# EAGLE design M1_Shield_Radio_V1.3.2 (EAGLE 9.5.2)
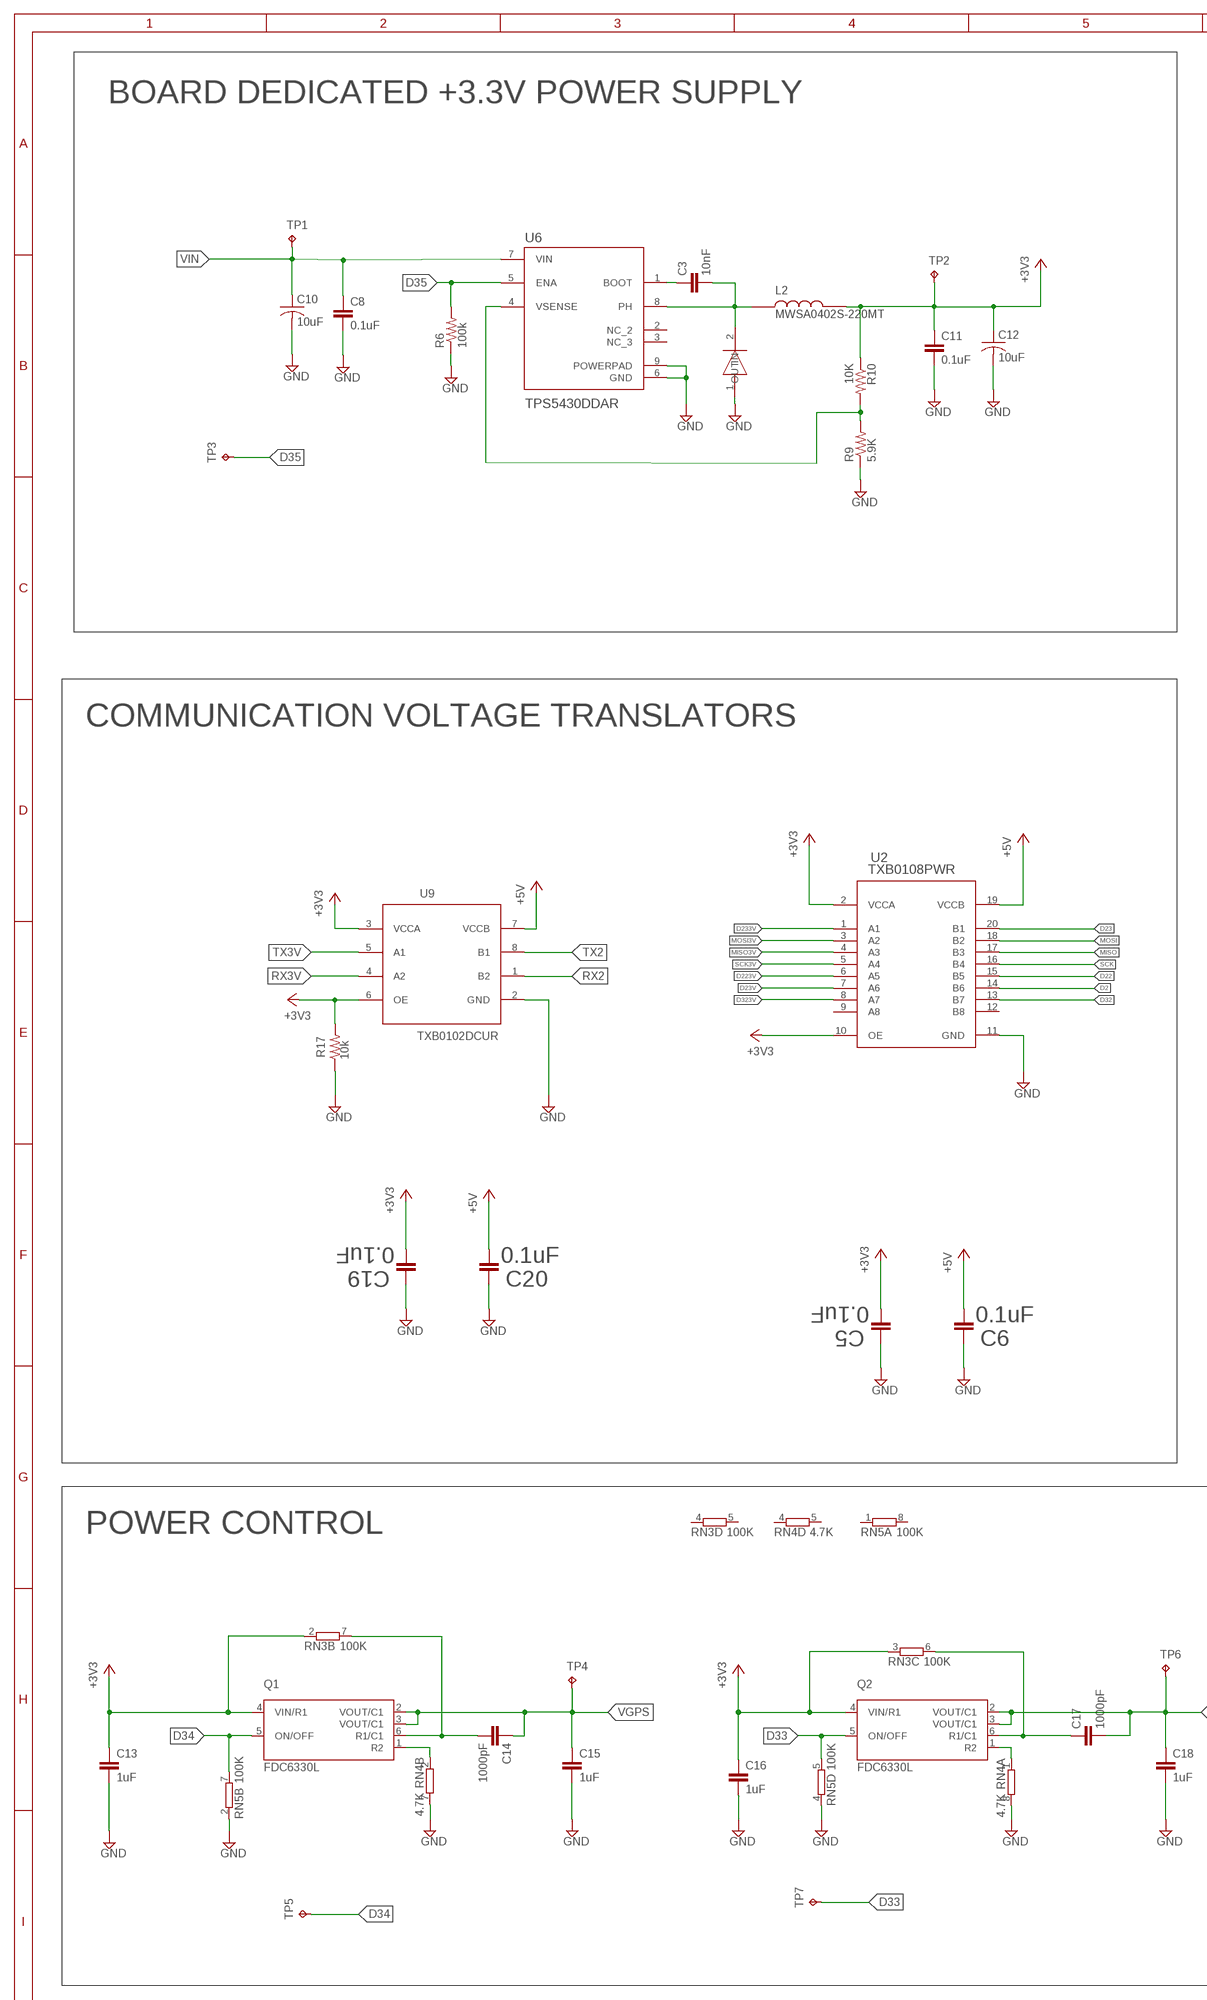
[diagram p0: schematic, sheet 1, part 1 of 2]
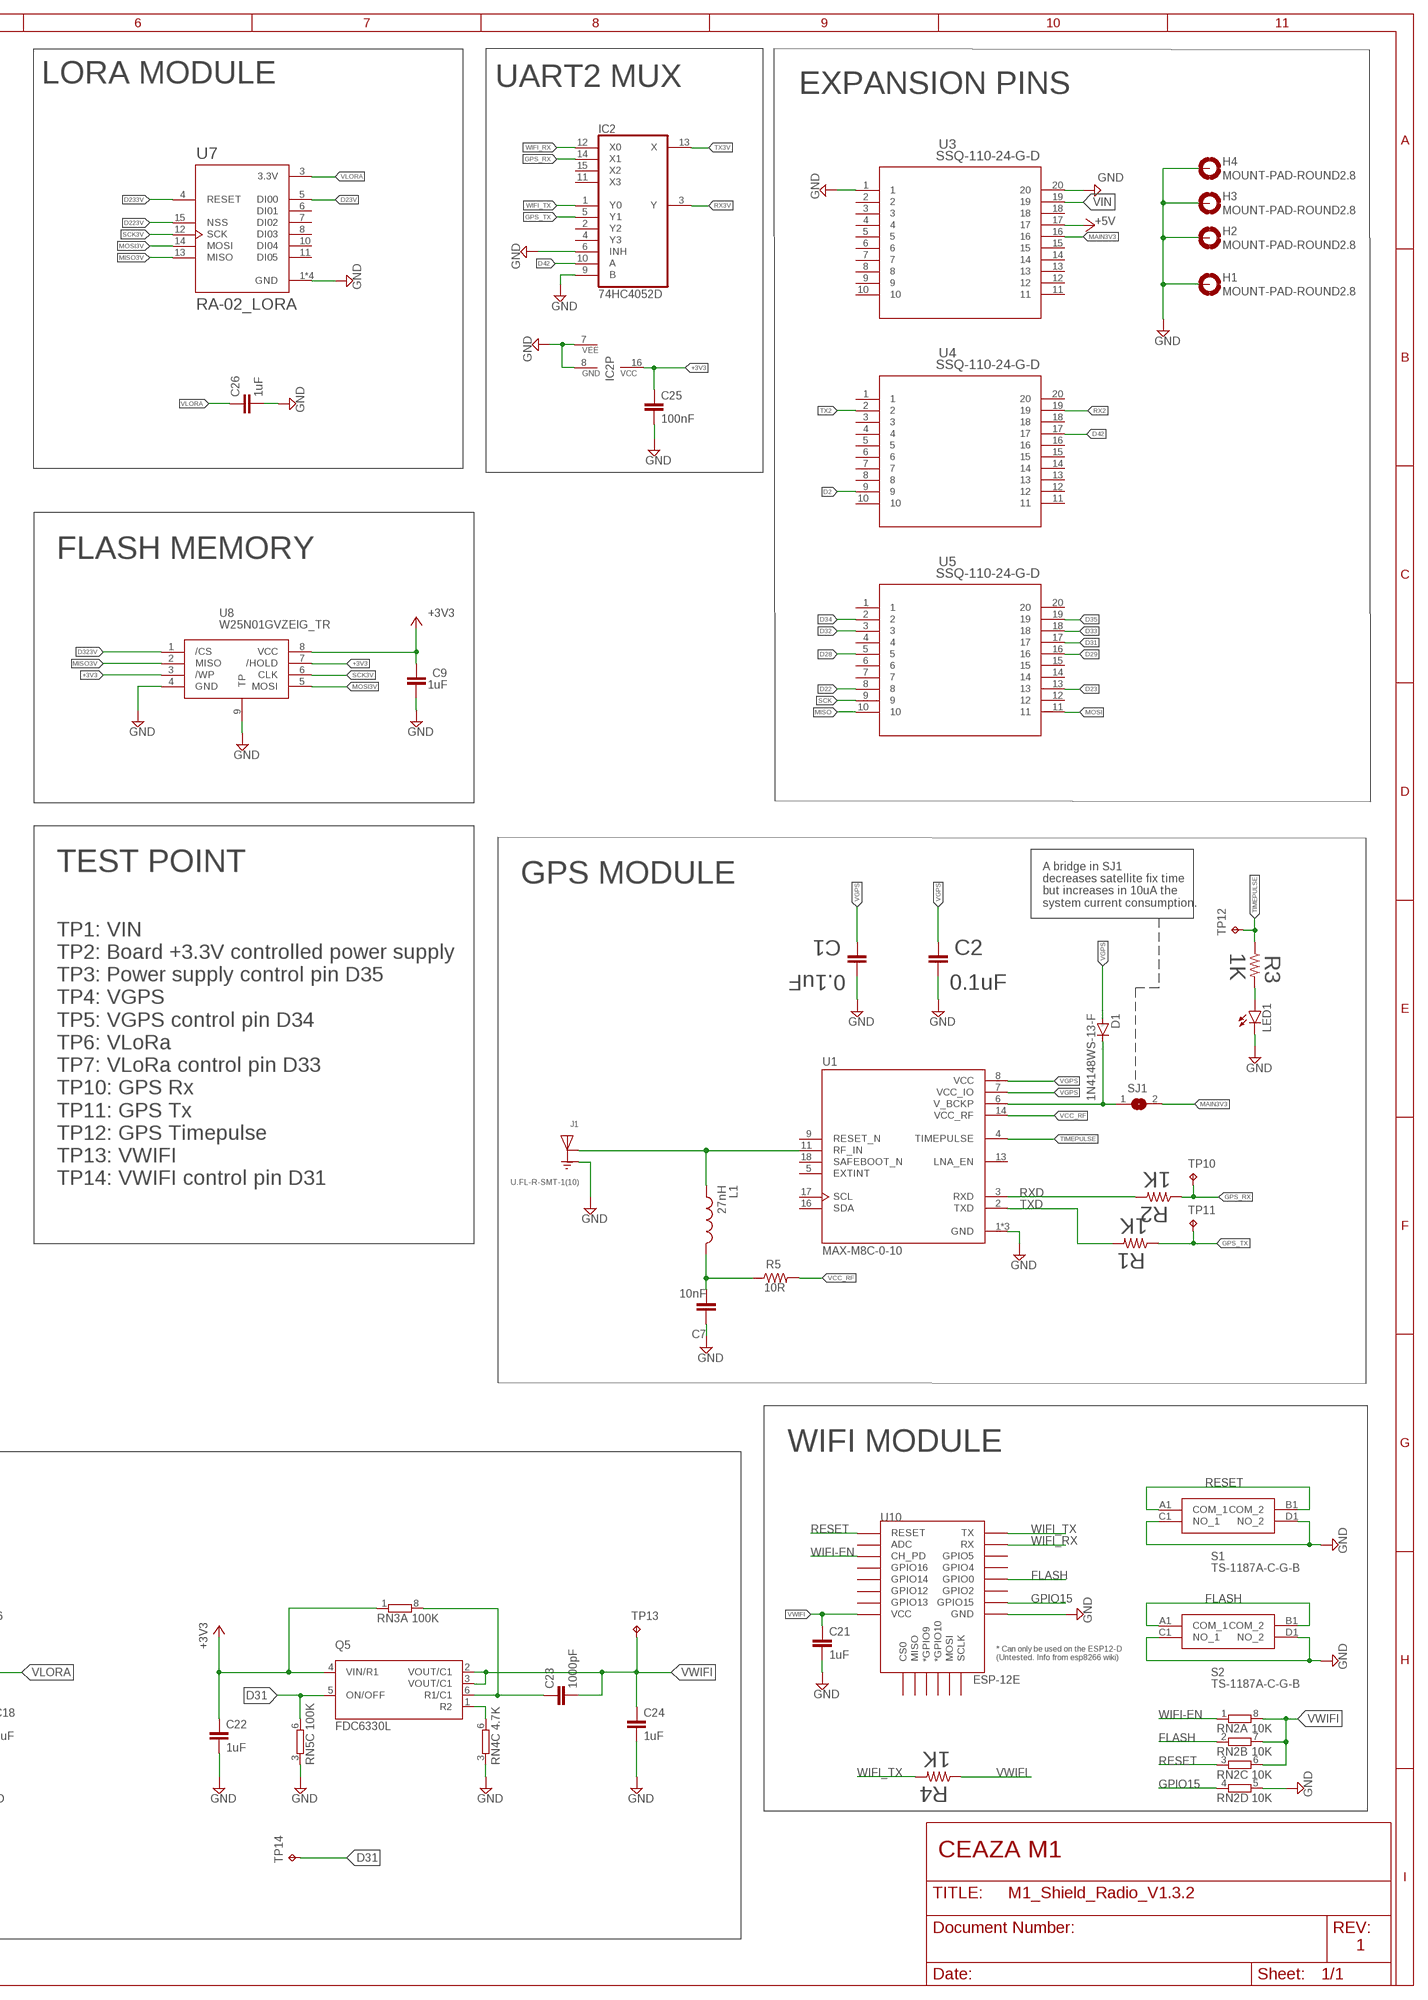
[diagram p1: schematic, sheet 1, part 2 of 2]

## Parts
C1  0.1uF  C-EUC0603K  [C0603K]
C2  0.1uF  C-EUC0603K  [C0603K]
C3  10nF  C-EUC0603K  [C0603K]
C5  0.1uF  C-EUC0603K  [C0603K]
C6  0.1uF  C-EUC0603K  [C0603K]
C7  10nF  C-EUC0603K  [C0603K]
C8  0.1uF  C-EUC0603K  [C0603K]
C9  1uF  C-EUC0603K  [C0603K]
C10  10uF  C-USC0603K  [C0603K]
C11  0.1uF  C-EUC0603K  [C0603K]
C12  10uF  C-USC0603K  [C0603K]
C13  1uF  C-EUC0603K  [C0603K]
C14  1000pF  C-EUC0603K  [C0603K]
C15  1uF  C-EUC0603K  [C0603K]
C16  1uF  C-EUC0603K  [C0603K]
C17  1000pF  C-EUC0603K  [C0603K]
C18  1uF  C-EUC0603K  [C0603K]
C19  0.1uF  C-EUC0603K  [C0603K]
C20  0.1uF  C-EUC0603K  [C0603K]
C21  1uF  C-EUC0603K  [C0603K]
C22  1uF  C-EUC0603K  [C0603K]
C23  1000pF  C-EUC0603K  [C0603K]
C24  1uF  C-EUC0603K  [C0603K]
C25  100nF  C-EUC0603K  [C0603K]
C26  1uF  C-EUC0603K  [C0603K]
D1  1N4148WS-13-F  DIODE-SOD323-W  [SOD323-W]
H1  MOUNT-PAD-ROUND2.8  [2,8-PAD]
H2  MOUNT-PAD-ROUND2.8  [2,8-PAD]
H3  MOUNT-PAD-ROUND2.8  [2,8-PAD]
H4  MOUNT-PAD-ROUND2.8  [2,8-PAD]
IC2  74HC4052D  4052D  [SO16]
J1  U.FL-R-SMT-1(10)  [HRS_U.FL-R-SMT-1(10)]
L1  27nH  LQG15HS27NJ02D  [INDC1005X55N]
L2  MWSA0402S-220MT  [MWSA0402S-220MT]
LED1  LEDCHIP-LED0805  [CHIP-LED0805]
Q1  FDC6330L  [SOT95P280X110-6N]
Q2  FDC6330L  [SOT95P280X110-6N]
Q5  FDC6330L  [SOT95P280X110-6N]
R1  1K  R-US_R0603  [R0603]
R2  1K  R-US_R0603  [R0603]
R3  1K  R-US_R0603  [R0603]
R4  1K  R-US_R0603  [R0603]
R5  10R  R-US_R0603  [R0603]
R6  100k  R-US_R0603  [R0603]
R9  5.9K  R-US_R0603  [R0603]
R10  10K  R-US_R0603  [R0603]
R17  10k  R-US_R0603  [R0603]
RN2  10K  4R-N0603-ARV  [0603-ARV]
RN3  100K  4R-N0603-ARV  [0603-ARV]
RN4  4.7K  4R-N0603-ARV  [0603-ARV]
RN5  100K  4R-N0603-ARV  [0603-ARV]
S1  TS-1187A-C-G-B  [TS1187ACGB]
S2  TS-1187A-C-G-B  [TS1187ACGB]
SJ1  SJ  [SJ]
TP1  TPB1,27  [B1,27]
TP2  TPB1,27  [B1,27]
TP3  TPB1,27  [B1,27]
TP4  TPB1,27  [B1,27]
TP5  TPB1,27  [B1,27]
TP6  TPB1,27  [B1,27]
TP7  TPB1,27  [B1,27]
TP10  TPB1,27  [B1,27]
TP11  TPB1,27  [B1,27]
TP12  TPB1,27  [B1,27]
TP13  TPB1,27  [B1,27]
TP14  TPB1,27  [B1,27]
U1  MAX-M8C-0-10  [XCVR_MAX-M8C-0-10]
U2  TXB0108PWR  [PW0020A_N]
U3  SSQ-110-24-G-D  1-215307-0  [1-215307-0]
U4  SSQ-110-24-G-D  1-215307-0  [1-215307-0]
U5  SSQ-110-24-G-D  1-215307-0  [1-215307-0]
U6  TPS5430DDAR  [CONV_TPS5430DDAR]
U7  RA-02_LORA  [MODULE_RA-02_LORA]
U8  W25N01GVZEIG_TR  [W25N01GVZEIGTR]
U9  TXB0102DCUR  TXB0102DCURDCU0008A_L  [DCU0008A_L]
U10  ESP-12E  ESP12ESMD  [ESP12E-SMD]
U$1  SMA-SS34  [SMA-SS34]

## Nets
+3V3: C5.2 C9.1 C11.1 C12.1 C13.1 C16.1 C19.2 C22.1 C25.1 IC2.16(VCC) L2.P$2 Q1.4(VIN/R1) Q2.4(VIN/R1) Q5.4(VIN/R1) R10.1 R17.2 RN3.1 RN3.2 RN3.3 TP2.TP U2.2(VCCA) U2.10(OE) U8.3(/WP) U8.7(/HOLD) U8.8(VCC) U9.3(VCCA) U9.6(OE)
+5V: C6.2 C20.2 U2.19(VCCB) U3.17 U9.7(VCCB)
D2: U2.14(B6) U4.9
D22: U2.15(B5) U5.8
D23: U2.20(B1) U5.13
D23V: U2.7(A6) U7.5(DI00)
D28: U5.5
D29: U5.16
D31: Q5.5(ON/OFF) RN5.6 TP14.TP U5.17
D32: U2.13(B7) U5.3
D33: Q2.5(ON/OFF) RN5.5 TP7.TP U5.18
D34: Q1.5(ON/OFF) RN5.7 TP5.TP U5.2
D35: R6.2 TP3.TP U5.19 U6.5(ENA)
D42: IC2.10(A) U4.17
D223V: U2.6(A5) U7.15(NSS)
D233V: U2.1(A1) U7.4(RESET)
D323V: U2.8(A7) U8.1(/CS)
FLASH: RN2.2 S2.A1(COM_1) S2.B1(COM_2) U10.GPIO0
GND: C1.1 C2.1 C5.1 C6.1 C7.1 C8.2 C9.2 C10.2 C11.2 C12.2 C13.2 C15.2 C16.2 C18.2 C19.1 C20.1 C21.2 C22.2 C24.2 C25.2 C26.2 H1.B2,8(MOUNT) H2.B2,8(MOUNT) H3.B2,8(MOUNT) H4.B2,8(MOUNT) IC2.6(INH) IC2.7(VEE) IC2.8(GND) IC2.9(B) J1.1(GND) J1.3(GND) LED1.C R6.1 R9.1 R17.1 RN2.5 RN4.3 RN4.7 RN4.8 RN5.2 RN5.3 RN5.4 S1.C1(NO_1) S1.D1(NO_2) S2.C1(NO_1) S2.D1(NO_2) U1.1(GND) U1.10(GND) U1.12(GND) U2.11(GND) U3.1 U3.20 U6.6(GND) U6.9(POWERPAD) U7.1(GND) U7.2(GND) U7.9(GND) U7.16(GND) U8.4(GND) U8.9(TP) U9.2(GND) U10.GND U$1.1(IN)
GPIO15: RN2.4 U10.GPIO15
GPS_RX: IC2.14(X1) R2.1 TP10.TP
GPS_TX: IC2.5(Y1) R1.1 TP11.TP
MAIN3V3: SJ1.2 U3.16
MISO: U2.17(B3) U5.10
MISO3V: U2.4(A3) U7.13(MISO) U8.2(MISO)
MOSI: U2.18(B2) U5.11
MOSI3V: U2.3(A2) U7.14(MOSI) U8.5(MOSI)
N$3: Q5.1(R2) RN4.6
N$4: LED1.A R3.2
N$5: J1.2(SIG) L1.1 U1.11(RF_IN)
N$6: C7.2 L1.2 R5.1
N$7: C3.1 U6.1(BOOT)
N$15: C14.2 Q1.6(R1/C1) RN3.7
N$16: C23.1 Q5.6(R1/C1) RN3.8
N$17: Q1.1(R2) RN4.2
N$19: Q2.1(R2) RN4.1
N$20: C17.1 Q2.6(R1/C1) RN3.6
N$21: D1.C SJ1.1 U1.6(V_BCKP)
N$22: C3.2 L2.P$1 U6.8(PH) U$1.2(OUT)
RESET: RN2.3 S1.A1(COM_1) S1.B1(COM_2) U10.RESET
RX2: U4.19 U9.1(B2)
RX3V: IC2.3(Y) U9.4(A2)
RXD: R2.2 U1.3(RXD)
SCK: U2.16(B4) U5.9
SCK3V: U2.5(A4) U7.12(SCK) U8.6(CLK)
TIMEPULSE: R3.1 TP12.TP U1.4(TIMEPULSE)
TX2: U4.2 U9.8(B1)
TX3V: IC2.13(X) U9.5(A1)
TXD: R1.2 U1.2(TXD)
VCC_RF: R5.2 U1.14(VCC_RF)
VFB: R9.2 R10.2 U6.4(VSENSE)
VGPS: C1.2 C2.2 C14.1 C15.1 D1.A Q1.2(VOUT/C1) Q1.3(VOUT/C1) TP4.TP U1.7(VCC_IO) U1.8(VCC)
VIN: C8.1 C10.1 TP1.TP U3.19 U6.7(VIN)
VLORA: C17.2 C18.1 C26.1 Q2.2(VOUT/C1) Q2.3(VOUT/C1) TP6.TP U7.3(3.3V)
VWIFI: C21.1 C23.2 C24.1 Q5.2(VOUT/C1) Q5.3(VOUT/C1) R4.1 RN2.6 RN2.7 RN2.8 TP13.TP U10.VCC
WIFI-EN: RN2.1 U10.CH_PD
WIFI_RX: IC2.12(X0) U10.RXD0(RX)
WIFI_TX: IC2.1(Y0) R4.2 U10.TXD0(TX)
Unconnected: IC2.2(Y2) IC2.4(Y3) IC2.11(X3) IC2.15(X2) RN3.4 RN3.5 RN4.4 RN4.5 RN5.1 RN5.8 U1.5(EXTINT) U1.9(RESET_N) U1.13(LNA_EN) U1.16(SDA) U1.17(SCL) U1.18(SAFEBOOT_N) U2.9(A8) U2.12(B8) U3.2 U3.3 U3.4 U3.5 U3.6 U3.7 U3.8 U3.9 U3.10 U3.11 U3.12 U3.13 U3.14 U3.15 U3.18 U4.1 U4.3 U4.4 U4.5 U4.6 U4.7 U4.8 U4.10 U4.11 U4.12 U4.13 U4.14 U4.15 U4.16 U4.18 U4.20 U5.1 U5.4 U5.6 U5.7 U5.12 U5.14 U5.15 U5.20 U6.2(NC_2) U6.3(NC_3) U7.6(DI01) U7.7(DI02) U7.8(DI03) U7.10(DI04) U7.11(DI05) U10.ADC U10.CS0 U10.GPIO2 U10.GPIO4 U10.GPIO5 U10.GPIO9(*GPIO9) U10.GPIO10(*GPIO10) U10.GPIO12 U10.GPIO13 U10.GPIO14 U10.GPIO16 U10.MISO U10.MOSI U10.SCLK

## Notes on the sheet
- LORA MODULE | UART2 MUX
- BOARD DEDICATED +3.3V POWER SUPPLY | EXPANSION PINS
- FLASH MEMORY
- COMMUNICATION VOLTAGE TRANSLATORS
- TEST POINT
- GPS MODULE
- A bridge in SJ1 
  decreases satellite fix time 
  but increases in 10uA the 
  system current consumption.
- TP1: VIN
  TP2: Board +3.3V controlled power supply
  TP3: Power supply control pin D35
  TP4: VGPS
  TP5: VGPS control pin D34
  TP6: VLoRa
  TP7: VLoRa control pin D33
  TP10: GPS Rx
  TP11: GPS Tx
  TP12: GPS Timepulse
  TP13: VWIFI
  TP14: VWIFI control pin D31
- WIFI MODULE
- POWER CONTROL
- CEAZA M1
- 1

## Library data of the parts
C1-C3 C5-C9 C11 C13-C26 = rcl:C-EU: CAPACITOR, European symbol; SPICEPREFIX: C
C10 C12 = rcl:C-US: CAPACITOR, American symbol; SPICEPREFIX: C
D1 = diode:DIODE-: DIODE
H1-H4 = holes:MOUNT-PAD-ROUND: MOUNTING PAD, round
IC2 = 40xx:4052: Dual 4-channel ANALOG MULTIPLEXER
J1 = U.FL-R-SMT-1_10_:U.FL-R-SMT-1(10): U.FL Series 6 Ghz 50 Ohm Ultra-small SMT Coaxial Cable Receptacle; DESCRIPTION: U.FL _UMCC_ Connector Receptacle, Male Pin 50Ohm Surface Mount Solder; DIGI-KEY_PART_NUMBER: H11891CT-ND; DIGI-KEY_PURCHASE_URL: https://www.digikey.com/product-detail/en/hirose-electric-co-ltd/U.FL-R-SMT-1_10_/H11891CT-ND/2504612?utm_source=snapeda&utm_medium=aggregator&utm_campaign=symbol; MF: Hirose; MP: U.FL-R-SMT-1_10_; PACKAGE: None
L1 = LQG15HS27NJ02D:LQG15HS27NJ02D: Inductor RF Chip Unshielded Multi-Layer 27nH 5% 100MHz 8Q-Factor Ceramic 300mA 460mOhm DCR 0402 T/R; DESCRIPTION: Inductor with Inductance: 27nH Tol. +/-5%, Package: 0402 _1005_; DIGI-KEY_PART_NUMBER: 490-2628-1-ND; DIGI-KEY_PURCHASE_URL: https://www.digikey.cl/product-detail/en/murata-electronics/LQG15HS27NJ02D/490-2628-1-ND/662908?utm_source=snapeda&utm_medium=aggregator&utm_campaign=symbol; MF: Murata; MP: LQG15HS27NJ02D; PACKAGE: 1005 Murata
L2 = MWSA0402S-220MT:MWSA0402S-220MT
LED1 = led:LED: LED OSRAM: - CHIPLED LG R971, LG N971, LY N971, LG Q971, LY Q971, LO R971, LY R971 LH N974, LH R974 LS Q976, LO Q976, LY Q976 LO Q996 - Hyper CHIPLED LW Q18S LB Q993, LB Q99A, LB R99A - SideLED LS A670, LO A670, LY A670, LG A670, LP A670 LB A673, LV A673, LT A673, LW A673 LH A674 LY A675 LS A676, LA A676, LO A676, LY A676, LW A676 LS A679, LY A679, LG A679 - Hyper Micro SIDELED® LS Y876, LA Y876, LO Y876, LY Y876 LT Y87S - SmartLED LW L88C, LW L88S LB L89C, LB L89S, LG L890 LS L89K, LO L89K, LY L89K LS L896, LA L896, LO L896, LY L896 - TOPLED LS T670, LO T670, LY T670, LG T670, LP T670 LSG T670, LSP T670, LSY T670, LOP T670, LYG T670 LG T671, LOG T671, LSG T671 LB T673, LV T673, LT T673, LW T673 LH T674 LS T676, LA T676, LO T676, LY T676, LB T676, LH T676, LSB T676, LW T676 LB T67C, LV T67C, LT T67C, LS T67K, LO T67K, LY T67K, LW E67C LS E67B, LA E67B, LO E67B, LY E67B, LB E67C, LV E67C, LT E67C LW T67C LS T679, LY T679, LG T679 LS T770, LO T770, LY T770, LG T770, LP T770 LB T773, LV T773, LT T773, LW T773 LH T774 LS E675, LA E675, LY E675, LS T675 LS T776, LA T776, LO T776, LY T776, LB T776 LHGB T686 LT T68C, LB T68C - Hyper Mini TOPLED® LB M676 - Mini TOPLED Santana® LG M470 LS M47K, LO M47K, LY M47K Source: http://www.osram.convergy.de LUXEON: - LUMILED® LXK2-PW12-R00, LXK2-PW12-S00, LXK2-PW14-U00, LXK2-PW14-V00 LXK2-PM12-R00, LXK2-PM12-S00, LXK2-PM14-U00 LXK2-PE12-Q00, LXK2-PE12-R00, LXK2-PE12-S00, LXK2-PE14-T00, LXK2-PE14-U00 LXK2-PB12-K00, LXK2-PB12-L00, LXK2-PB12-M00, LXK2-PB14-N00, LXK2-PB14-P00, LXK2-PB14-Q00 LXK2-PR12-L00, LXK2-PR12-M00, LXK2-PR14-Q00, LXK2-PR14-R00 LXK2-PD12-Q00, LXK2-PD12-R00, LXK2-PD12-S00 LXK2-PH12-R00, LXK2-PH12-S00 LXK2-PL12-P00, LXK2-PL12-Q00, LXK2-PL12-R00 Source: www.luxeon.com KINGBRIGHT: KA-3528ASYC Source: www.kingbright.com
Q1 Q2 Q5 = FDC6330L:FDC6330L: FDC6330 Series 20 V 2.3 A High Side Integrated Load Switch - SSOT-6; DESCRIPTION: Power Switch/Driver 1:1 P-Channel 2.3A SuperSOT™-6; DIGI-KEY_PART_NUMBER: FDC6330LCT-ND; DIGI-KEY_PURCHASE_URL: https://www.digikey.com/product-detail/en/on-semiconductor/FDC6330L/FDC6330LCT-ND/1626189?utm_source=snapeda&utm_medium=aggregator&utm_campaign=symbol; MF: ON Semiconductor; MP: FDC6330L; PACKAGE: TSOT-23-6 ON Semiconductor
R1-R6 R9 R10 R17 = rcl:R-US_: RESISTOR, American symbol; SPICEPREFIX: R
RN2-RN5 = resistor-dil:4R-N: Array Chip Resistor Source: RS Component / Phycomp; OC_FARNELL: unknown; OC_NEWARK: unknown
S1 S2 = TS-1187A-C-G-B:TS-1187A-C-G-B: Tact Switch Source: Datasheet <https://datasheet.lcsc.com/szlcsc/XKB-TS-1187A-C-G-A_C318886.pdf>; DESCRIPTION: Tact Switch; HEIGHT: 3.7mm; MANUFACTURER_NAME: XKB Enterprise; MANUFACTURER_PART_NUMBER: TS-1187A-C-G-B
SJ1 = jumper:SJ: SMD solder JUMPER
TP1-TP7 TP10-TP14 = testpad:TP: Test pad
U1 = MAX-M8C-0-10:MAX-M8C-0-10: Ic Receiver Gps/Gnss 18lcc; DESCRIPTION: u-blox M8 GNSS module, ROM, crystal; DIGI-KEY_PART_NUMBER: 672-1002-1-ND; DIGI-KEY_PURCHASE_URL: https://www.digikey.com/product-detail/en/u-blox/MAX-M8C-0-10/672-1002-1-ND/6150665?utm_source=snapeda&utm_medium=aggregator&utm_campaign=symbol; MF: U-Blox America; MP: MAX-M8C-0-10; PACKAGE: SMD-18 u-blox
U2 = TXB0108PWR:TXB0108PWR; MANUFACTURER: Texas Instruments; PARTNUMBER: TXB0108PWR; REFDES: RefDes; TYPE: TYPE; VALUE: Value
U3-U5 = 1-215307-0:1-215307-0; BUILT_BY: EMA_UL_Team; MANUFACTURER_PART_NUMBER: 1-215307-0; VENDOR: TE Connectivity
U6 = TPS5430DDAR:TPS5430DDAR: 5.5V to 36V Input, 3A, 500kHz Step-Down Converter 8-SO PowerPAD -40 to 125 Check prices <https://snapeda.com/parts/TPS5430DDAR/Texas%20Instruments/view-part/?ref=eda>; ARROW_ELECTRONICS-PURCHASE-URL: https://snapeda.com/shop?store=Arrow+Electronics&id=423058; AVAILABILITY: Good; DESCRIPTION: 5.5V to 36V Input, 3A, 500kHz Step-Down Converter 8-SO PowerPAD -40 to 125; DIGIKEY-PURCHASE-URL: https://snapeda.com/shop?store=DigiKey&id=423058; MF: Texas Instruments; MOUSER-PURCHASE-URL: https://snapeda.com/shop?store=Mouser&id=423058; MP: TPS5430DDAR; PACKAGE: HSOIC-8 Texas Instruments; PRICE: None; TEXAS_INSTRUMENTS-PURCHASE-URL: https://snapeda.com/shop?store=Texas+Instruments&id=423058
U7 = RA-02_LORA:RA-02_LORA: Ra-02 LoRa RF M5Stack Platform Evaluation Expansion Board; AVAILABILITY: Unavailable; DESCRIPTION: Ra-02 LoRa RF M5Stack Platform Evaluation Expansion Board; MF: AI-Thinker; MP: Ra-02 LoRa; PACKAGE: Package; PRICE: None
U8 = W25N01GVZEIG_TR:W25N01GVZEIG_TR
U9 = TXB0102DCUT:TXB0102DCUR; ALTERNATE_PARTNUMBER: TXB0102DCUT; COMPTYPE: IC; MANUFACTURER: Texas Instruments; MOUNTTYPE: SMT; PACKAGEREFERENCE: DCU0008A; PARTNUMBER: TXB0102DCUR; PIN_COUNT: 8; REFDES: RefDes; ROHS: Y; TYPE: TYPE; VALUE: Value
U10 = esp8266modules:ESP12E: ESP12E Module
U$1 = SMA-SS34:SMA-SS34

## Board
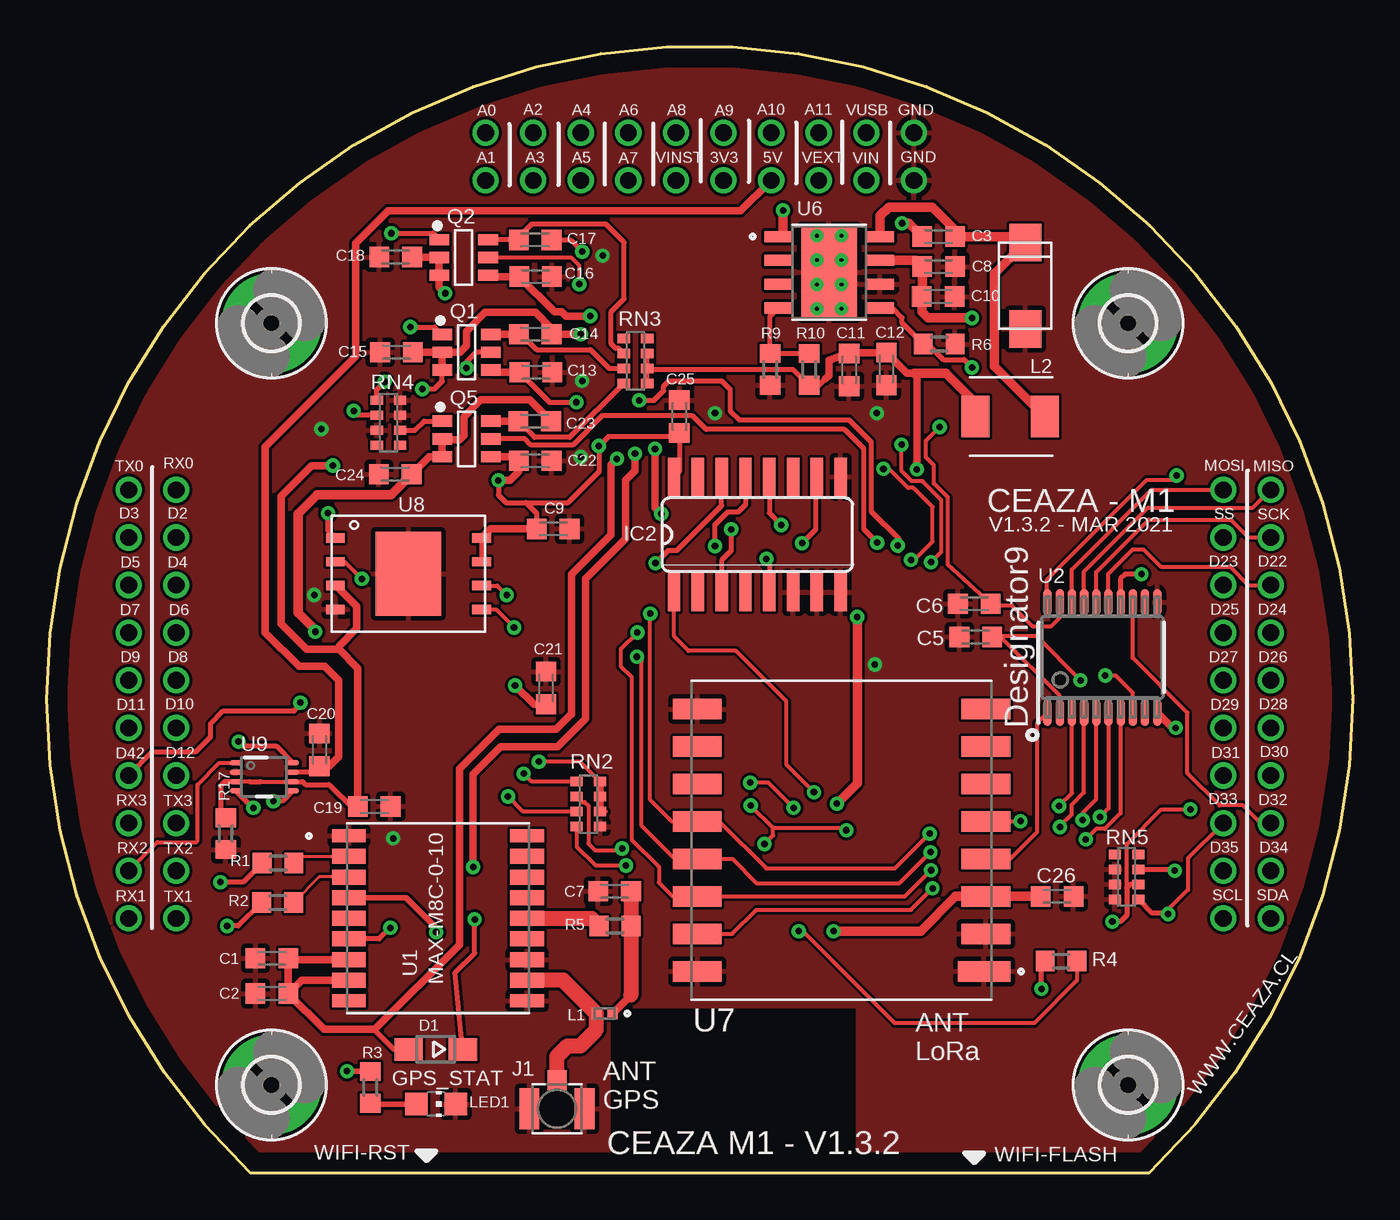
[diagram p2: board, top side]
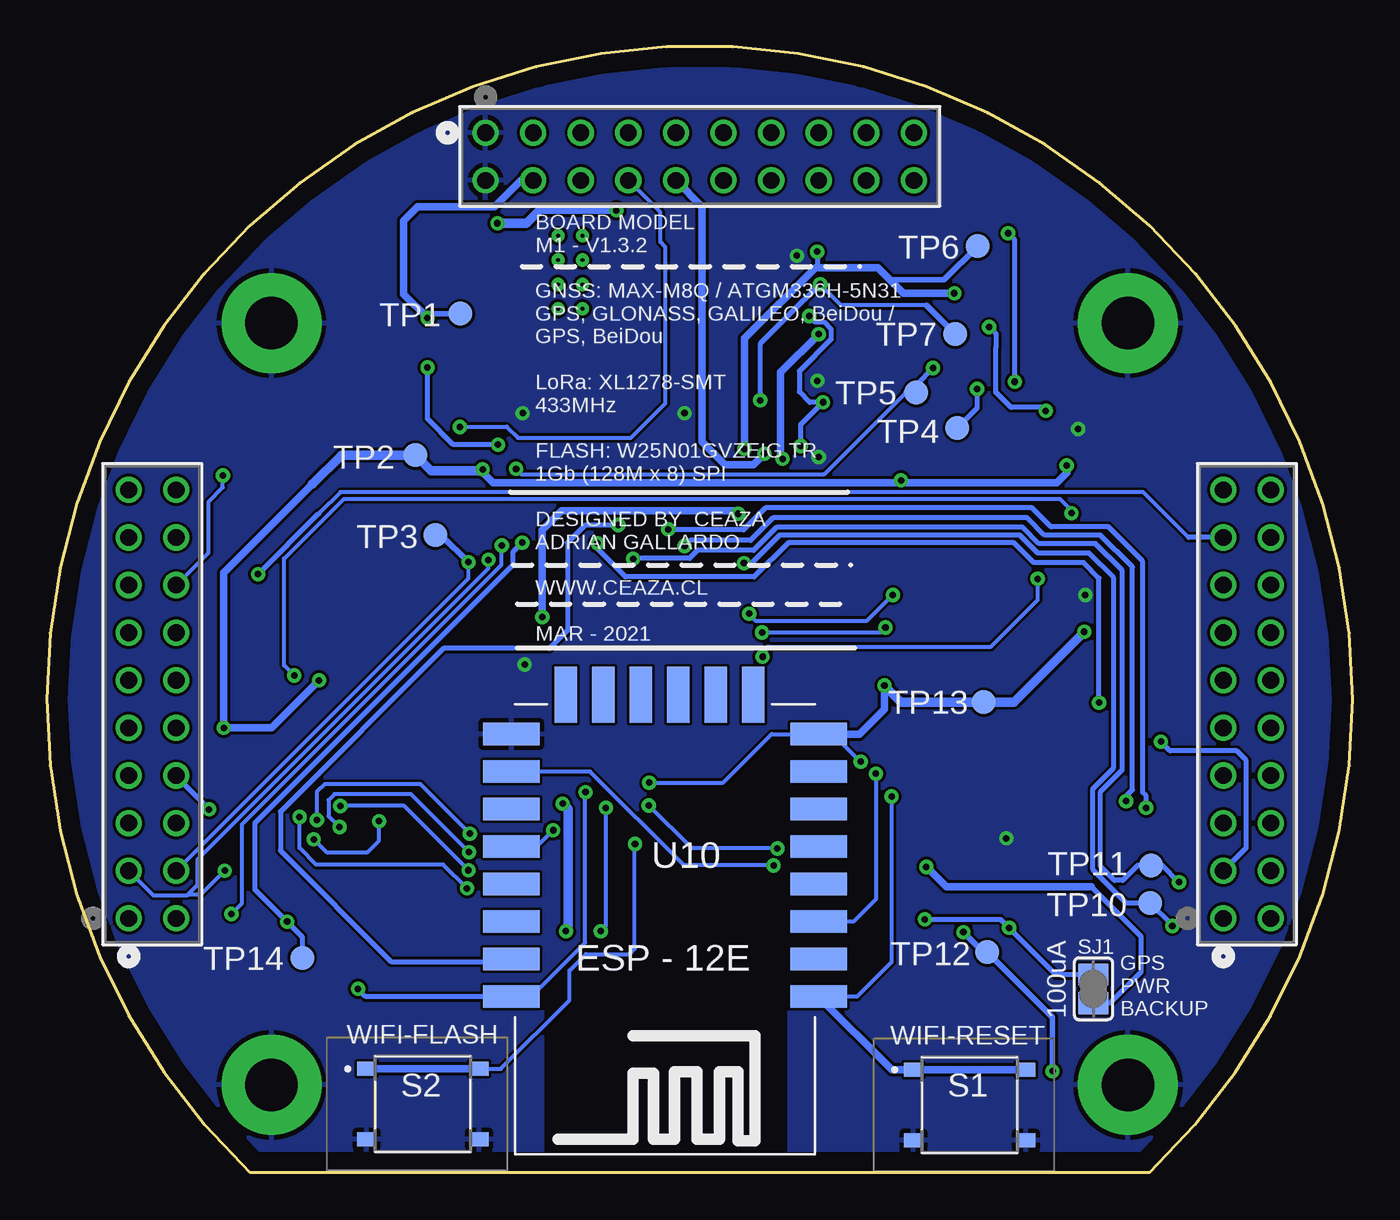
[diagram p3: board, bottom side, seen from below]

Size 69.69 x 60.06 mm. Coordinates in mm from the lower left corner, seen from the top.
Outline: 10.85,0 58.85,0 arc273 10.85,0
Copper layers (1*16): Top 0.035mm / dielectric 1.5mm / Bottom 0.035mm
Design rules "default *": minimum track width 6mil, minimum drill 0.35mm, track to track 6mil, track to pad 6mil, pad to pad 6mil, via to via 6mil, smd to smd 6mil, copper to edge 40mil, drill to drill 6mil, minimum pad ring 10mil, minimum via ring 8mil, stop-mask expansion 2mil, vias tented up to drill 24mil, thermal gap 10mil

### Footprints (pad centres in the part's own frame; a part is rotated, then mirrored left to right if it is on the bottom)
C0603K = smd 1.05 x 1.08: 1 -0.875,0; 2 0.875,0
SOD323-W = smd 1.5 x 1.2: A 1.45,0; C -1.45,0
2,8-PAD = drill 2.8 pad 5.334: B2,8 0,0
SO16 = smd 0.66 x 2.032: 1 -4.445,-3.073; 2 -3.175,-3.073; 3 -1.905,-3.073; 4 -0.635,-3.073; 5 0.635,-3.073; 6 1.905,-3.073; 7 3.175,-3.073; 8 4.445,-3.073; 9 4.445,3.073; 10 3.175,3.073; 11 1.905,3.073; 12 0.635,3.073; 13 -0.635,3.073; 14 -1.905,3.073; 15 -3.175,3.073; 16 -4.445,3.073
HRS_U.FL-R-SMT-1(10) = smd 1.05 x 2.2: 1 -1.475,0; 3 1.475,0 | smd 1 x 1.05: 2 0,-1.525
INDC1005X55N = smd 0.54 x 0.6: 1 -0.432,0; 2 0.432,0
MWSA0402S-220MT = smd 1.5 x 2.2: P$1 -1.8,0; P$2 1.9,0
CHIP-LED0805 = smd 1.2 x 1.2: A 0,-1.05; C 0,1.05
SOT95P280X110-6N = smd 1.05 x 0.6: 1 -1.3,0.95; 2 -1.3,0; 3 -1.3,-0.95; 4 1.3,-0.95; 5 1.3,0; 6 1.3,0.95
R0603 = smd 1 x 1.1: 1 -0.85,0; 2 0.85,0
0603-ARV = smd 0.5 x 0.65: 1 -1.2,-0.625; 2 -0.4,-0.625; 3 0.4,-0.625; 4 1.2,-0.625; 5 1.2,0.625; 6 0.4,0.625; 7 -0.4,0.625; 8 -1.2,0.625
TS1187ACGB = smd 1 x 0.75: A1 -3,1.875; B1 3,1.875; C1 -3,-1.875; D1 3,-1.875
SJ = smd 1.168 x 1.6: 1 -0.762,0; 2 0.762,0
B1,27 = smd 1.27 x 1.27: TP 0,0
XCVR_MAX-M8C-0-10 = smd 1.8 x 0.7: 1 -4.75,4.4; 9 -4.75,-4.4; 10 4.75,-4.4; 18 4.75,4.4 | smd 1.8 x 0.8: 2 -4.75,3.3; 3 -4.75,2.2; 4 -4.75,1.1; 5 -4.75,0; 6 -4.75,-1.1; 7 -4.75,-2.2; 8 -4.75,-3.3; 11 4.75,-3.3; 12 4.75,-2.2; 13 4.75,-1.1; 14 4.75,0; 15 4.75,1.1; 16 4.75,2.2; 17 4.75,3.3
PW0020A_N = smd 1.4 x 0.45: 1 -2.95,2.925; 2 -2.95,2.275; 3 -2.95,1.625; 4 -2.95,0.975; 5 -2.95,0.325; 6 -2.95,-0.325; 7 -2.95,-0.975; 8 -2.95,-1.625; 9 -2.95,-2.275; 10 -2.95,-2.925; 11 2.95,-2.925; 12 2.95,-2.275; 13 2.95,-1.625; 14 2.95,-0.975; 15 2.95,-0.325; 16 2.95,0.325; 17 2.95,0.975; 18 2.95,1.625; 19 2.95,2.275; 20 2.95,2.925
1-215307-0 = drill 0.889 pad 1.397: 1 -22.86,2.54; 2 -20.32,2.54; 3 -17.78,2.54; 4 -15.24,2.54; 5 -12.7,2.54; 6 -10.16,2.54; 7 -7.62,2.54; 8 -5.08,2.54; 9 -2.54,2.54; 10 0,2.54; 11 0,0; 12 -2.54,0; 13 -5.08,0; 14 -7.62,0; 15 -10.16,0; 16 -12.7,0; 17 -15.24,0; 18 -17.78,0; 19 -20.32,0; 20 -22.86,0
CONV_TPS5430DDAR = smd 1.55 x 0.6: 1 -2.7,1.905; 2 -2.7,0.635; 3 -2.7,-0.635; 4 -2.7,-1.905; 5 2.7,-1.905; 6 2.7,-0.635; 7 2.7,0.635; 8 2.7,1.905 | smd 2.95 x 4.9: 9 0,0 | drill 0.2 pad 0.3: 10 -0.65,1.95; 11 0.65,1.95; 12 -0.65,0.65; 13 0.65,0.65; 14 -0.65,-0.65; 15 0.65,-0.65; 16 -0.65,-1.95; 17 0.65,-1.95
MODULE_RA-02_LORA = smd 2.8 x 1.1: 1 -7.6,7 | smd 2.6 x 1.1: 2 -7.7,5; 3 -7.7,3; 4 -7.7,1; 5 -7.7,-1; 6 -7.7,-3; 7 -7.7,-5; 8 -7.7,-7; 9 7.7,-7; 10 7.7,-5; 11 7.7,-3; 12 7.7,-1; 13 7.7,1; 14 7.7,3; 15 7.7,5; 16 7.7,7
W25N01GVZEIGTR = smd 1 x 0.5: 1 -3.9,2.005; 2 -3.9,0.735; 3 -3.9,-0.535; 4 -3.9,-1.805; 5 3.9,-1.805; 6 3.9,-0.535; 7 3.9,0.735; 8 3.9,2.005 | smd 3.5 x 4.5: 9 0,0.1
DCU0008A_L = smd 0.65 x 0.3: 1 -1.525,0.75; 2 -1.525,0.25; 3 -1.525,-0.25; 4 -1.525,-0.75; 5 1.525,-0.75; 6 1.525,-0.25; 7 1.525,0.25; 8 1.525,0.75
ESP12E-SMD = smd 3 x 1.2: ADC -8.3,3.8; CH_PD -8.3,1.8; GND 8.1,-8.2; GPIO0 8.1,-2.2; GPIO2 8.1,-4.2; GPIO4 8.1,-0.2; GPIO5 8.1,1.8; GPIO12 -8.3,-4.2; GPIO13 -8.3,-6.2; GPIO14 -8.3,-2.2; GPIO15 8.1,-6.2; GPIO16 -8.3,-0.2; RESET -8.3,5.8; RXD0 8.1,3.8; TXD0 8.1,5.8; VCC -8.3,-8.2 | smd 1.2 x 3: CS0 -4.8,-10.3; GPIO9 -0.8,-10.3; GPIO10 1.2,-10.3; MISO -2.8,-10.3; MOSI 3.2,-10.3; SCLK 5.2,-10.3
SMA-SS34 = smd 2 x 1.7: 1 0,-1.4; 2 4.6,-1.4

### Placement (x,y rotation side)
C1  12.01,11.44 0 top
C2  12.01,9.56 0 top
C3  47.6,49.94 0 top
C5  49.58,28.58 0 top
C6  49.5,30.36 0 top
C7  30.3,15.02 0 top
C8  47.6,48.34 0 top
C9  27.02,34.35 0 top
C10  47.57,46.74 0 top
C11  42.82,42.83 270 top
C12  44.8,42.88 270 top
C13  26.11,42.7 0 top
C14  26.06,44.74 180 top
C15  18.67,43.77 180 top
C16  26.08,47.81 0 top
C17  26.06,49.77 0 top
C18  18.62,48.85 180 top
C19  17.47,19.54 180 top
C20  14.55,22.56 270 top
C21  26.64,25.86 90 top
C22  26.06,37.98 0 top
C23  26.03,40.09 0 top
C24  18.59,37.27 180 top
C25  33.75,40.34 90 top
C26  53.92,14.74 0 top
D1  20.75,6.59 180 top
H1  11.99,45.32 0 top
H2  11.99,4.68 0 top
H3  57.71,45.32 0 top
H4  57.71,4.68 0 top
IC2  37.92,34.04 0 top
J1  27.23,3.41 180 top
L1  29.77,8.49 0 top
L2  51.46,40.34 180 top
LED1  20.77,3.66 270 top
Q1  22.4,43.77 0 top
Q2  22.25,48.83 0 top
Q5  22.4,39.15 0 top
R1  12.34,16.52 0 top
R2  12.32,14.41 0 top
R3  17.27,4.55 270 top
R4  54.12,11.28 180 top
R5  30.32,13.16 180 top
R6  47.62,44.2 180 top
R9  38.6,42.86 90 top
R10  40.69,42.86 90 top
R17  9.55,18.09 90 top
RN2  28.9,19.67 270 top
RN3  31.42,43.31 90 top
RN4  18.23,40.01 270 top
RN5  57.63,15.78 270 top
S1  20.44,3.61 0 bottom
S2  49.63,3.66 0 bottom
SJ1  13.84,9.81 270 bottom
TP1  47.62,45.83 0 bottom
TP2  50.03,38.28 0 bottom
TP3  48.97,34.02 0 bottom
TP4  21.1,39.73 0 bottom
TP5  23.29,41.61 0 bottom
TP6  20.01,49.43 0 bottom
TP7  21.21,44.74 0 bottom
TP10  10.82,14.38 0 bottom
TP11  10.77,16.39 0 bottom
TP12  19.5,11.77 0 bottom
TP13  19.68,25.1 0 bottom
TP14  56.05,11.46 0 bottom
U1  20.88,13.57 0 top
U2  56.33,27.49 90 top
U3  23.42,52.94 0 bottom
U4  4.37,36.43 90 bottom
U5  62.79,36.43 90 bottom
U6  41.75,48.04 0 top
U7  42.41,17.74 180 top
U8  19.3,31.86 0 top
U9  11.6,21.11 0 top
U10  36.8,15.2 180 bottom
U$1  50.82,45.02 90 top

### Tracks (layer width: path | path; a pad name or v marks a point on that pad's centre or on a via)
+3V3  (via drill 0.35)
  Top 0.152: 50.54,28.55 50.48,28.61 50.52,28.61
  Top 0.203: 10.91,20.86 10.82,20.86 U9.3 | 11.41,20.86 U9.6 | U2.2 54.06,25.43 50.94,28.55 50.54,28.55 50.5,28.58 C5.2 | v55.17,26.27 52.83,28.61 50.52,28.61
  Top 0.254: RN3.1 RN3.2 | RN3.2 RN3.3 | RN3.2 32.12,42.84 39.86,42.84 R10.1 41.21,42.01 41.56,42.36 | v24.1,36.94 24.1,36.15 24.51,35.74 25.57,35.74 25.6,35.72 | C9.1 26.15,35.17 25.6,35.72 | C13.1 26.83,41.1 v28.27,41.1 | 25.6,35.72 27.78,35.72 29.46,37.4 v29.46,38.77 29.97,39.27 33.56,39.27 C25.1 33.75,37.4 IC2.16 | U9.6 13.64,20.86 13.8,20.71 15.06,20.71 15.24,20.53 | 10.82,20.86 11.41,20.86 | U9.3 9.5,20.86 9.27,20.63 9.27,19.22 R17.2 | U8.8 U8.7
  Top 0.305: C19.2 16.23,19.54 15.24,20.53
  Top 0.406: C13.1 23.82,42.7 Q1.4 | v46.43,37.52 46.43,42.5 46.28,42.65 45.91,42.65 C12.1 42.87,43.76 C11.1 41.73,43.36 41.73,42.53 41.56,42.36 | v29,45.7 27.7,45.7 27.47,45.93 27.09,45.93 C16.1 23.61,47.81 Q2.4 | v60.25,23.73 60.22,23.75 60.04,23.75 U2.10 | U8.8 23.68,34.35 C9.1 | Q5.4 24.96,38.2 C22.1 25.18,37.41 24.71,36.94 v24.1,36.94 | v15.26,37.73 14.13,37.73 12.49,36.09 12.49,29.29 13.87,27.92 15.59,27.92 | C19.2 16.6,26.92 15.59,27.92 | 15.59,27.92 15.59,28.1 16.53,29.04 16.53,30.23 15.44,31.32 U8.3
  Top 0.508: 46.28,42.65 47.98,42.65 49.56,41.07 L2.P$2
  Bottom 0.254: 46.5,37.45 v46.43,37.52 | v29.46,38.77 29.46,39.91 v28.27,41.1 28.98,41.1 29.54,41.66 29.54,42.76 27.84,44.46 27.84,45.01 28.22,45.39 28.7,45.39 v29,45.7
  Bottom 0.406: 24.23,36.81 15.8,36.81 15.26,37.34 v15.26,37.73 | 24.23,36.81 45.87,36.81 46.5,37.45 | 55.52,36.73 60.25,32.01 v60.25,23.73 57.71,23.73 v55.17,26.27 | v24.1,36.94 24.23,36.81
  Bottom 0.508: 55.52,36.73 53.97,38.28 TP2.TP 49.2,37.45 46.5,37.45
+5V  (via drill 0.35)
  Top 0.203: U2.19 54.06,29.61 53.62,29.17 52.6,29.17 51.48,30.28 50.45,30.28 C6.2 48.08,32.44 48.08,36.04 47.34,36.78 47.34,37.75 46.91,38.18 46.91,39.05 v47.65,39.78 | 38.59,52.88 U3.17 | 16.48,46.03 16.48,46.11
  Top 0.254: U9.7 14.55,21.36 C20.2
  Top 0.406: 16.48,46.03 16.48,43.57 11.66,38.74 11.66,28.81 13.46,27.01 14.83,27.01 15.57,26.26 15.57,22.19 15.07,21.69 C20.2 | 16.48,46.11 16.48,49.59 18.21,51.31 37.03,51.31 38.59,52.88
  Bottom 0.203: v47.65,39.78 47.62,39.8 45.15,39.8 44.54,39.2 38.52,39.2 36.67,41.05 36.67,49.38 36.95,49.66 36.95,51.23 U3.17
D2  (via drill 0.35)
  Top 0.254: U2.14 57.3,31.68 57.55,31.93 v58.42,31.93
  Bottom 0.203: 8.76,33.89 11.18,36.3 54.02,36.3 55.18,35.15
  Bottom 0.254: U4.9 8.76,33.89 | v58.42,31.93 55.2,35.15 55.18,35.15
D22
  Top 0.203: U2.15 56.65,31.95 57.95,33.25 58.53,33.25 59.45,32.33 63.15,32.33 64.13,31.35 U5.8
D23  (via drill 0.35)
  Top 0.203: v60.3,37.19 60.07,36.96 58.72,36.96 53.38,31.62 53.38,30.47 U2.20
  Bottom 0.203: U5.13 61.06,33.08 61.06,35.8 60.3,36.56 v60.3,37.19
D23V  (via drill 0.35)
  Top 0.203: U2.7 57.3,24.53 57.3,19.18 56.47,18.35 56.01,18.35 v55.44,17.79 | v51.96,18.75 51.95,18.74 U7.5
  Bottom 0.203: v55.44,17.79 54.76,17.1 52.57,17.1 51.96,17.71 v51.96,18.75
D31  (via drill 0.35)
  Top 0.203: 57.63,15.2 57.63,17.53 59.48,19.39 v61.03,19.39
  Top 0.254: RN5.6 57.81,15.38 57.63,15.2 57.63,13.72 57.3,13.39 v56.87,13.39 | Q5.5 25.52,39.15 25.85,38.82 28.07,38.82 29.63,40.37 34.46,40.37 35.18,39.65 42.57,39.65 43.59,38.64 43.59,34.34 v44.32,33.61
  Bottom 0.254: v61.03,19.39 62.79,21.14 U5.17 | v44.32,33.61 44.81,33.12 44.81,32.43 58.59,18.64 58.59,15.12 v56.87,13.39 56.05,12.58 TP14.TP
D32
  Top 0.203: U5.3 64.79,18.65 63.84,19.6 62.6,19.6 60.88,21.32 60.88,24.55 57.96,27.47 U2.13
D33  (via drill 0.35)
  Top 0.203: v45.41,33.46 45.41,33.23 45.46,33.18 | v59.84,13.8 59.84,14.03 60.91,15.09 60.91,16.77 U5.18 | v28.42,47.4 28.42,48.4 27.99,48.83 Q2.5
  Top 0.254: RN5.5 58.98,13.85 59.79,13.85 v59.84,13.8 | 45.46,33.18 45.46,33.81 43.99,35.28 43.99,38.99 42.82,40.16 36.95,40.16 36.47,40.65 36.47,41.79 36.01,42.25 33.19,42.25 32.92,41.97 32.92,41.71 32.41,41.21 v31.62,41.21
  Bottom 0.203: v45.41,33.46 45.44,33.43 45.44,32.41 59.28,18.57 59.28,14.36 v59.84,13.8 | 22.76,46.29 27.3,46.29 v28.42,47.4
  Bottom 0.254: v28.42,47.4 29.26,46.56 29.28,46.56 31.62,44.22 v31.62,41.21
  Bottom 0.305: TP7.TP 22.76,46.29
D34  (via drill 0.35)
  Top 0.203: v46.12,32.7 46.3,32.7 47.27,33.66 47.27,35.52 46.25,36.53 45.96,36.53 44.95,37.55 v44.65,37.55
  Top 0.254: RN5.7 58.27,16.16 60.14,16.16 v60.19,16.11 | Q1.5 22.91,43.77 22.4,43.26 v22.4,42.93
  Top 0.406: 23.72,43.75 Q1.5
  Bottom 0.203: U5.2 64,14.79 62.2,14.79 62.16,14.83 | v46.12,32.7 46.12,32.24 61.63,16.73 61.63,15.36 62.16,14.83 | v44.65,37.55 44.37,37.27 28.19,37.27 23.85,41.61 | v60.19,16.11 61.48,14.83 62.16,14.83
  Bottom 0.254: v22.4,42.93 23.29,42.04 TP5.TP
  Bottom 0.305: TP5.TP 23.85,41.61
D35  (via drill 0.35)
  Top 0.203: v47.19,32.57 47.72,33.1 47.72,35.9 46.73,36.89 46.17,36.89 45.62,37.44 v45.62,38.84
  Top 0.254: U6.5 45.13,46.13 45.64,45.62 45.64,45.33 R6.2 47.03,44.2 47.86,43.37 48.96,43.37 v49.37,42.96
  Bottom 0.203: v47.19,32.57 47.19,31.71 U5.19
  Bottom 0.254: v45.62,38.84 48,38.84 49.37,40.22 v49.37,42.96
  Bottom 0.305: v47.19,32.57 48.64,34.02 TP3.TP
D42  (via drill 0.35)
  Top 0.254: U4.17 5.64,22.46 7.95,22.46 8.73,23.25 8.73,23.96 9.42,24.64 13.2,24.64 13.53,24.97 v13.53,25.08 | v40.31,33.59 41.04,34.33 41.04,37.07 IC2.10
  Bottom 0.254: v13.53,25.08 13.53,31.72 14.36,32.54 17.01,32.54 18.07,33.6 30.12,33.6 31.94,31.78 38.81,31.78 40.31,33.28 v40.31,33.59
D223V  (via drill 0.35)
  Top 0.203: U7.15 36.58,12.74 37.87,14.03 46.12,14.03 v47.27,15.17 | U2.6 56.66,19.43 v56.21,18.98
  Bottom 0.203: v47.27,15.17 48.54,16.44 55.32,16.44 56.21,17.33 v56.21,18.98
D233V
  Top 0.203: U7.4 51.42,16.74 52.85,18.16 52.85,23.98 U2.1
D323V  (via drill 0.35)
  Top 0.203: U2.8 57.96,25.61 57.05,26.52 v56.49,26.52
  Top 0.254: U8.1 15.01,34.26 v15.01,35.19
  Bottom 0.203: v56.49,26.52 57.03,27.07 57.03,32.76 53.84,35.95 15.62,35.95 15.01,35.34 v15.01,35.19
FLASH  (via drill 0.35)
  Top 0.203: RN2.2 28.57,19.77 28.71,19.77 28.9,19.57 28.9,17.56 29.26,17.2 30.61,17.2 v30.71,17.3 | v37.56,19.59 38.76,18.4 | v42.67,18.27 42.54,18.4 38.76,18.4 | v38.3,17.53 38.76,17.99 38.76,18.4
  Top 0.406: 28.23,20.02 RN2.2
  Bottom 0.203: v30.71,17.3 35.27,17.3 v37.56,19.59 | v42.67,18.27 43.54,17.4 U10.GPIO0 | S2.B1 45.47,5.54 41.81,9.2 41.81,10.78 40.92,11.67 38.6,11.67 38.33,11.94 38.33,17.51 v38.3,17.53
  Bottom 0.406: S2.A1 S2.B1
GND  (via drill 0.35)
  other vias: 18.49,17.84 35.66,40.52 44.29,40.52 28.57,42.25 44.19,27.11 29.66,48.93 28.5,38.18 14.27,30.82 14.65,39.68
  pour Top: 29.97,-0.6 29.97,8.87 29.94,8.9 43.15,8.9 43.28,9.02 43.28,-0.86 43.41,-0.98 61.06,-0.98 68.42,6.38 70.71,8.67 70.71,34.68 70.71,40.9 54.05,57.56 49.4,62.21 19.89,62.21 -0.89,41.43 -0.89,13.54 -0.89,7.4 7.36,-0.86 29.74,-0.86 29.77,-0.86 29.97,-0.65
  pour Bottom: 30.02,-0.68 30.02,8.92 30.05,8.95 43.28,8.95 43.28,-0.96 43.38,-1.06 63.07,-1.06 71.12,6.99 71.12,40.9 48.66,63.35 21.89,63.35 -2.34,39.12 -2.34,11.03 9.34,-0.65 29.99,-0.65
GPIO15  (via drill 0.35)
  Top 0.203: RN2.4 28.28,17.4 29.29,16.39 v30.91,16.39
  Bottom 0.203: v30.91,16.39 35.68,16.39 40.69,21.4 U10.GPIO15
GPS_RX  (via drill 0.35)
  Top 0.254: R2.1 10.22,13.16 v9.62,13.16 | v32.48,32.52 33.17,33.2 33.63,33.2 36.01,35.59 IC2.14
  Bottom 0.254: v9.62,13.16 9.62,13.19 TP10.TP 12.08,14.38 13.87,16.17 13.87,20.49 12.76,21.6 12.76,31.74 14.07,33.05 16.8,33.05 17.77,34.02 30.58,34.02 32.08,32.52 v32.48,32.52
GPS_TX  (via drill 0.35)
  Top 0.254: R1.1 10.48,15.5 v9.27,15.5 | v38.4,32.75 38.55,32.59 IC2.5
  Bottom 0.254: v9.27,15.5 10.16,16.39 TP11.TP 11.46,16.39 12.26,15.59 12.71,15.59 13.46,16.34 13.46,20.33 12.3,21.49 12.3,32.14 13.72,33.56 16.74,33.56 17.6,34.42 30.75,34.42 31.97,33.2 34.96,33.2 35.39,32.78 38.37,32.78 v38.4,32.75
MAIN3V3  (via drill 0.35)
  Top 0.406: v22.75,16.31 22.75,21.26 24.22,22.72 27.26,22.72 28.76,24.22 28.76,31.69 30.88,33.81 30.88,36.94 31.39,37.45 v31.39,38.36
  Bottom 0.254: 13.94,15.24 11.3,12.61 11.3,10.7 12.95,9.05 SJ1.2
  Bottom 0.406: 13.94,15.24 21.68,15.24 v22.75,16.31 | v31.39,38.36 31.98,37.78 33.5,37.78 34.72,39 34.72,51.54 U3.16
MISO
  Top 0.203: U2.17 55.35,32.07 58.76,35.48 64.37,35.48 U5.10
MISO3V  (via drill 0.35)
  Top 0.203: v47.16,17.1 45.51,15.45 37.87,15.45 36.58,16.74 U7.13 33.51,16.74 31.75,18.5 31.75,27.27 v31.49,27.53 | v54.07,18.45 54.07,18.5 54.68,19.11 54.68,19.61 55.36,20.29 U2.4 | U8.2 15.9,32.59 v16.81,31.68
  Bottom 0.203: v47.16,17.1 50.26,20.2 54.34,20.2 54.65,19.88 54.65,19.03 v54.07,18.45 | v31.49,27.53 31.49,27.76 31.19,28.07 19.3,28.07 16.81,30.56 v16.81,31.68
MOSI
  Top 0.203: U2.18 54.7,32.18 58.95,36.43 U5.11
MOSI3V  (via drill 0.35)
  Top 0.203: v47.19,16.13 45.79,14.74 U7.14 33.4,14.74 32.66,15.47 32.66,16.31 31.21,17.76 31.21,26.45 30.63,27.03 30.63,27.93 v31.52,28.82 | v54.02,19.56 54.71,20.25 U2.3 | U8.5 23.97,30.05 v24.94,29.09
  Bottom 0.203: v47.19,16.13 50.62,19.56 v54.02,19.56 | v24.94,29.09 25.21,28.81 v31.51,28.81 v31.52,28.82
N$3
  Top 0.254: RN4.6 19.62,39.61 19.63,39.61 20.12,40.1 Q5.1
N$4
  Top 0.305: LED1.A 17.31,3.66 R3.2
N$5
  Top 0.813: U1.11 27.55,10.27 L1.1 29.33,7.63 28.47,6.76 27.78,6.76 27.23,6.2 J1.2
N$6
  Top 0.406: 31.17,9.47 L1.2
  Top 0.813: C7.2 R5.1 31.17,9.47
N$7  (via drill 0.35)
  Top 0.508: C3.1 46.01,50.65 v45.64,50.65 | v39.29,51.34 39.29,50.18 U6.1
  Bottom 0.508: v45.64,50.65 44.09,50.65 43.35,51.39 39.34,51.39 v39.29,51.34
N$15
  Top 0.254: C14.2 25.31,44.74 26.13,43.92 29.01,43.92 30.01,42.91 RN3.7
  Top 0.406: Q1.6 25.17,44.72 C14.2
N$16
  Top 0.254: RN3.8 27.9,39.22 26.02,39.22 C23.1
  Top 0.406: C23.1 23.71,40.09 Q5.6
N$17  (via drill 0.35)
  Top 0.254: RN4.2 16.61,40.41 v16.38,40.65 | v19.4,45.12 20.7,45.12 Q1.1
  Bottom 0.254: v16.38,40.65 16.56,40.82 18.23,40.82 19.05,41.64 19.05,44.03 19.02,44.05 19.02,44.74 v19.4,45.12
N$19  (via drill 0.35)
  Top 0.254: RN4.1 17.61,41.77 v18.03,42.2 | v18.39,50.12 20.6,50.12 Q2.1
  Bottom 0.254: v18.03,42.2 18.03,49.77 v18.39,50.12
N$20
  Top 0.254: RN3.6 30.52,43.98 30.35,43.98 30.12,44.21 30.12,45.93 30.81,46.62 30.81,49.64 29.84,50.6 25.88,50.6 25.18,49.91 C17.1 23.56,49.77 Q2.6
N$21  (via drill 0.35)
  Top 0.254: v18.34,13.06 17.74,12.47 U1.6 | D1.C 21.8,10.68 22.83,11.72 v22.83,13.52
  Bottom 0.254: SJ1.1 15.85,10.57 v18.34,13.06 18.79,13.52 v22.83,13.52
N$22
  Top 0.508: L2.P$1 50.57,43.03 50.57,47.96 U$1.2 51.89,49.94 C3.2 48.47,50.31 47.27,51.52 44.93,51.52 44.45,51.04 U6.8
RESET  (via drill 0.35)
  Top 0.203: RN2.3 25.42,19.27 v24.61,20.07
  Bottom 0.203: v24.61,20.07 24.61,11.23 26.45,9.4 U10.RESET
  Bottom 0.406: S1.B1 S1.A1 24.59,5.49 U10.RESET
RX2
  Top 0.203: U4.19 5.89,17.63 7.97,17.63 8.05,17.71 8.05,20.71 9.2,21.86 U9.1
RX3V  (via drill 0.35)
  Top 0.254: U9.4 10.98,19.46 v11.02,19.46 | v36.52,34.32 36.52,33.18 36.01,32.67 IC2.3
  Bottom 0.254: v11.02,19.46 11.02,20.1 11.2,20.28 11.2,32.61 13.04,34.45 16.1,34.45 17.12,35.47 31.33,35.47 32.5,34.3 36.5,34.3 v36.52,34.32
RXD
  Top 0.152: R2.2 14.54,15.78 U1.3
SCK
  Top 0.203: U2.16 56,32.03 58.81,34.84 63.18,34.84 64.13,33.89 U5.9
SCK3V  (via drill 0.35)
  Top 0.203: v47.11,18.09 45.26,16.24 38.4,16.24 35.9,18.74 U7.12 33.36,18.74 32.2,19.89 v32.2,29.83 | v55.28,18.81 55.28,19.19 55.99,19.9 55.99,24.52 U2.5 | U8.6 24.04,31.32 v24.54,30.82
  Bottom 0.203: v47.11,18.09 49.76,20.73 54.86,20.73 55.28,20.31 v55.28,18.81 | v32.2,29.83 32.2,29.78 31.87,29.45 25.91,29.45 v24.54,30.82
TIMEPULSE  (via drill 0.35)
  Top 0.305: R3.1 16.04,5.4 v16.02,5.42 | v20.77,12.83 20.77,13.07 19.17,14.67 U1.4
  Bottom 0.305: v16.02,5.42 16.02,8.29 TP12.TP 19.71,11.77 v20.77,12.83
TX2  (via drill 0.35)
  Top 0.254: v10.23,22.99 10.46,22.76 12.23,22.76 U9.8
  Bottom 0.254: U4.2 5.69,17.33 5.69,22 6.19,22.51 9.75,22.51 v10.23,22.99
TX3V  (via drill 0.35)
  Top 0.254: U9.5 12.58,19.82 v12.09,19.82 | v35.66,33.43 35.66,34.58 36.34,35.26 36.9,35.26 37.31,35.67 37.31,37.09 IC2.13
  Bottom 0.254: v12.09,19.82 12.09,20.1 11.76,20.43 11.76,32.32 13.46,34.02 16.45,34.02 17.36,34.93 30.93,34.93 32.13,33.74 35.35,33.74 v35.66,33.43
TXD
  Top 0.152: U1.2 16.1,16.85 13.52,16.85 R1.2
VCC_RF
  Top 0.406: 25.64,13.56 U1.14
  Top 0.813: R5.2 29.08,13.56 25.64,13.56
VFB
  Top 0.254: U6.4 38.6,45.68 R9.2 R10.2
VGPS  (via drill 0.35)
  Top 0.203: 12.87,11.37 C1.2
  Top 0.254: 12.89,11.23 C1.2 | D1.A 18.51,6.59 17.45,7.65 | v20.04,41.82 20.7,41.82 21.1,42.22 Q1.3
  Top 0.406: Q1.2 Q1.3 | C2.2 14.79,7.65 17.45,7.65 17.5,7.65 22.02,12.17 22.02,21.55 24.13,23.65 27.17,23.65 27.99,24.47 28.01,24.47 28.01,31.93 30.12,34.04 30.12,37.78 v30.43,38.08 | U1.7 12.87,11.37 | U1.8 13.6,10.27 C2.2 | C2.2 12.89,11.23 | C15.1 Q1.2 | Q1.2 22.04,43.77 22.4,44.13 22.4,44.9 23.39,45.89 26.08,45.89 26.93,45.04 C14.1 v28.5,44.74
  Bottom 0.254: TP4.TP 20.04,40.8 v20.04,41.82
  Bottom 0.406: v28.5,44.74 30.53,42.7 30.53,38.18 v30.43,38.08
VIN  (via drill 0.35)
  Top 0.508: U6.7 46.39,48.67 C8.1 46.72,46.77 C10.1 46.7,45.93 47.03,45.6 v49.37,45.6
  Bottom 0.305: TP1.TP 49.15,45.83 v49.37,45.6
  Bottom 0.406: U3.19 44.38,52.94 45.79,51.53 49.89,51.53 50.64,50.78 50.64,46.87 v49.37,45.6
VLORA  (via drill 0.35)
  Top 0.254: C17.2 27.95,49.77 v28.58,49.14
  Top 0.406: C18.1 20.92,48.85 Q2.2 Q2.3 20.95,47.23 v21.26,46.92 | v32.46,38.61 32.46,35.48 v32.79,35.16
  Top 0.508: C26.1 U7.3 48.5,14.74 46.64,12.88 v41.98,12.88 | v42.16,19.69 43.25,20.78 v43.25,29.65
  Bottom 0.254: v28.58,49.14 28.58,48.39 28.68,48.29
  Bottom 0.305: TP6.TP 21.82,47.63 24.69,47.63
  Bottom 0.406: v43.25,29.65 43.25,34.27 42.21,35.31 32.95,35.31 v32.79,35.16 | v21.26,46.92 23.98,46.92 24.69,47.63 25.35,48.29 28.68,48.29 32.46,44.51 v32.46,38.61
  Bottom 0.508: v41.98,12.88 41.88,12.99 41.88,19.41 v42.16,19.69
VWIFI  (via drill 0.35)
  Top 0.203: RN2.8 28.47,21.93 v26.26,21.93 | R4.1 54.97,10.25 52.7,7.98 45.26,7.98 40.36,12.88 v40.13,12.88 | v39.85,19.46 38.5,20.81 v37.54,20.81
  Top 0.254: RN2.6 29.81,19.27
  Top 0.406: C21.1 25.99,24.99 v24.99,25.99 | RN2.6 RN2.7 RN2.8 | Q5.3 21.05,38.25 | C23.2 25.76,41.23 23.16,41.23 22.27,40.34 22.27,39.35 22.02,39.1 21.05,39.1 Q5.2 Q5.3 | Q5.3 20.39,38.2 C24.1
  Top 0.508: C24.1 18.37,36.17 14.43,36.17 13.41,35.15 13.41,29.88 14.32,28.96 v14.32,28.86
  Bottom 0.203: v26.26,21.93 27.73,23.4 28.34,23.4 | v40.13,12.88 39.85,13.16 v39.85,19.46 | v37.54,20.81 33.6,20.81 31.01,23.4 U10.VCC
  Bottom 0.406: U10.VCC 28.34,23.4 26.32,23.4 24.99,24.72 v24.99,25.99
  Bottom 0.508: v14.32,28.86 18.08,25.1 TP13.TP 24.1,25.1 v24.99,25.99
WIFI-EN  (via drill 0.35)
  Top 0.203: RN2.1 25.87,20.87 v25.45,21.29
  Bottom 0.203: v25.45,21.29 25.45,14.59 26.64,13.4 U10.CH_PD
WIFI_RX  (via drill 0.35)
  Top 0.254: IC2.12 38.55,35.19 v39.19,34.55
  Bottom 0.254: v39.19,34.55 40.97,34.55 41.91,33.61 41.91,28.94 42.87,27.97 48.51,27.97 57.22,19.26 57.22,17.18 51.3,11.26 45.04,11.26 U10.RXD0
WIFI_TX  (via drill 0.35)
  Top 0.203: v40.94,20.3 39.47,21.77 39.47,25.15 36.78,27.84 34.24,27.84 33.47,28.61 IC2.1
  Top 0.254: v53.08,9.81 53.08,11.09 R4.2
  Bottom 0.203: U10.TXD0 43.85,9.4 40.97,12.28 40.97,20.28 v40.94,20.3
  Bottom 0.254: 44.86,9.35 U10.TXD0 52.67,9.4 v53.08,9.81

### Text on the board
tPlace: A0 | A2 | A4 | A6 | A8 | A9 | A10 | A11 | VUSB | GND | A1 | A3 | A5 | A7 | VINST | 3V3 | 5V | VEXT | VIN | GND | TX0 | RX0 | MOSI | MISO | D3 | D2 | SS | SCK | D5 | D4 | D23 | D22 | D7 | D6 | D25 | D24 | D9 | D8 | D27 | D26 | D11 | D10 | D29 | D28 | D42 | D12 | D31 | D30 | RX3 | D33 | D32 | TX3 | RX2 | TX2 | D35 | D34 | RX1 | TX1 | SCL | SDA | ANT / LoRa | GPS_STAT | WWW.CEAZA.CL | WIFI-RST | CEAZA M1 - V1.3.2 | WIFI-FLASH
bPlace: BOARD MODEL / M1 - V1.3.2 / / GNSS: MAX-M8Q / ATGM336H-5N31 / GPS, GLONASS, GALILEO, BeiDou / / GPS, BeiDou / / LoRa: XL1278-SMT / 433MHz / / FLASH: W25N01GVZEIG TR / 1Gb (128M x 8) SPI / / DESIGNED BY CEAZA / ADRIAN GALLARDO / / WWW.CEAZA.CL / / MAR - 2021 | GPS / PWR / BACKUP | 100uA | WIFI-RESET | WIFI-FLASH
tNames: CEAZA - M1 | V1.3.2 - MAR 2021 | ANT / GPS